# EAGLE design vcf3 (EAGLE 7.2.0)
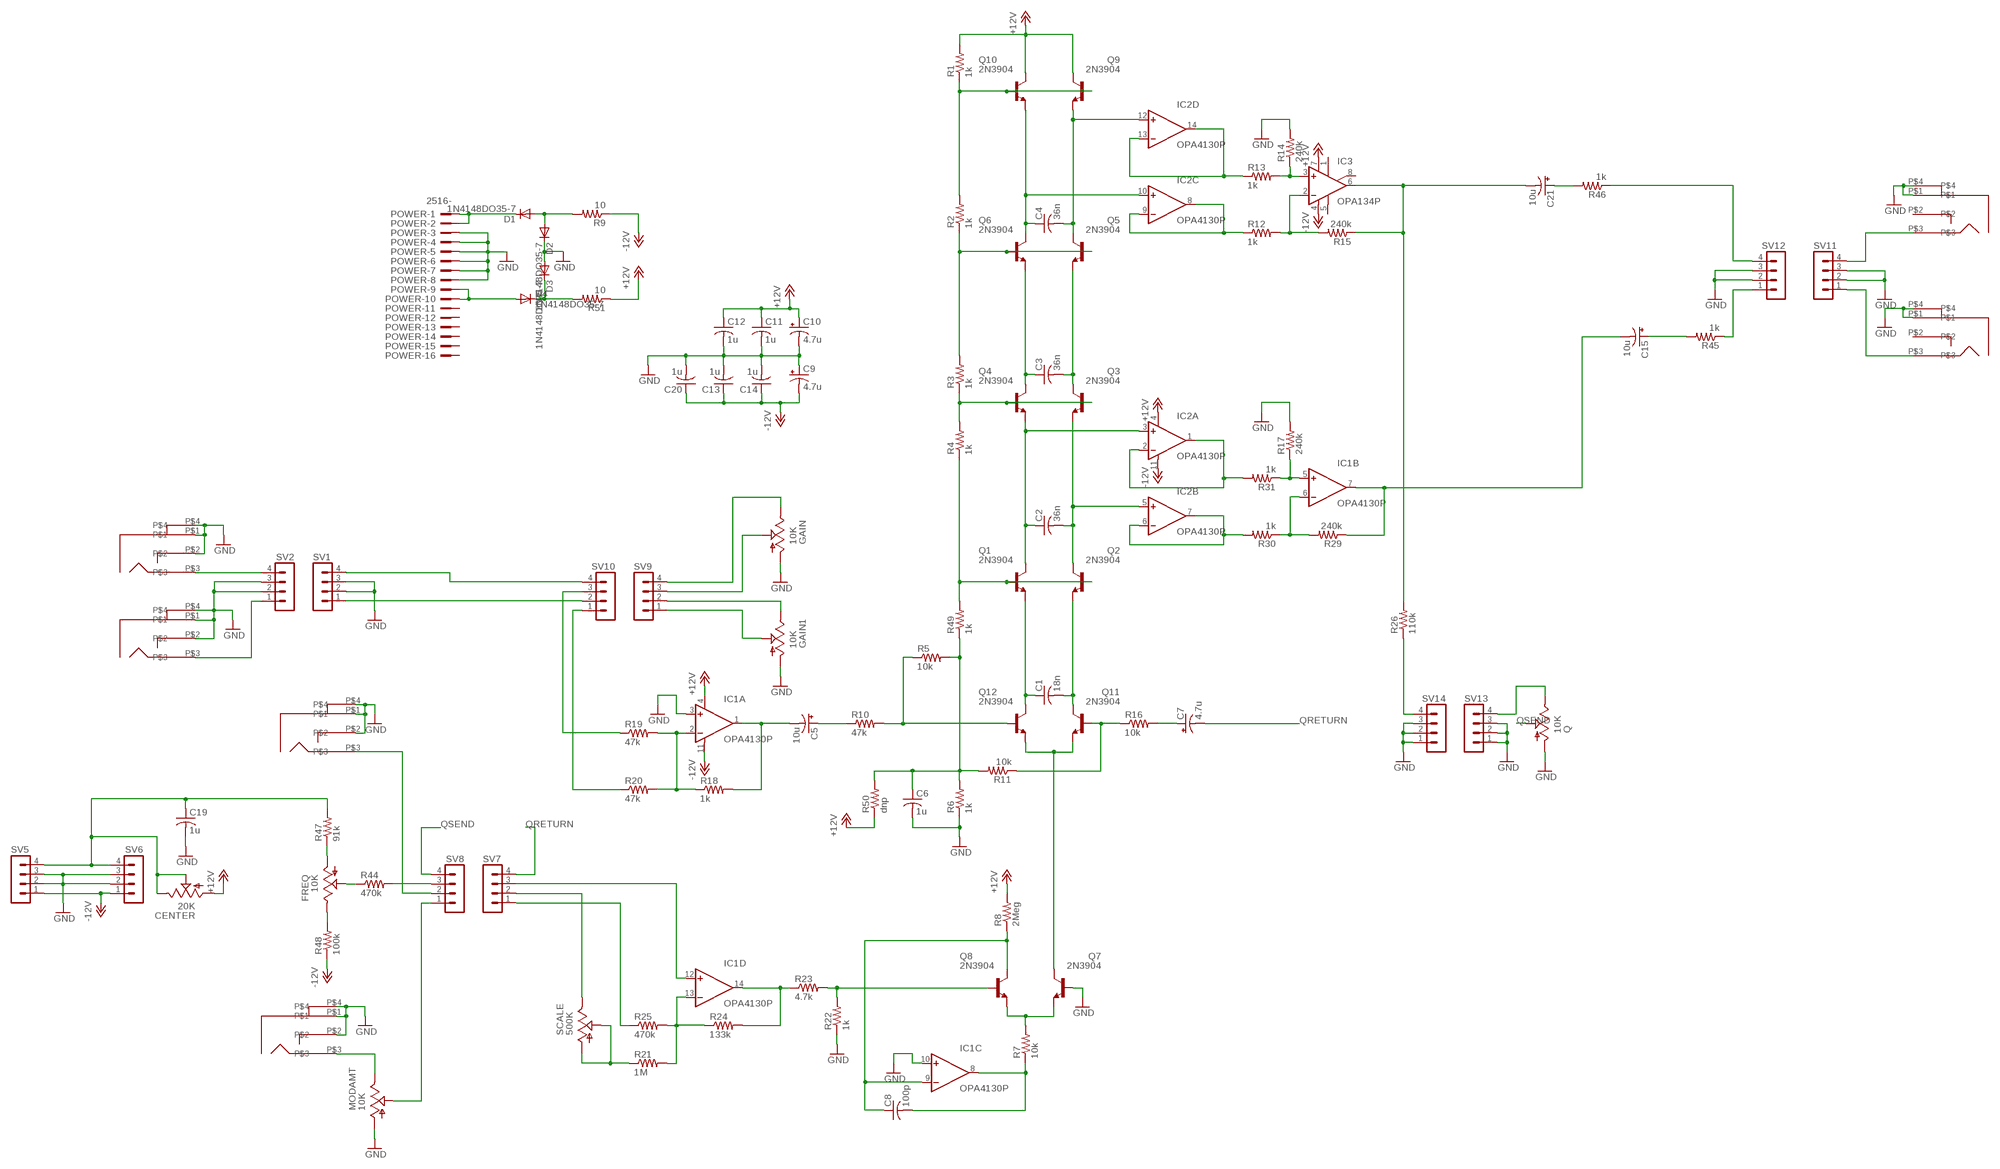
[diagram p0: schematic, sheet 1]

## Parts
AIN  PJ301BM  [PJ301BM]
AIN2  PJ301BM  [PJ301BM]
BP  PJ301BM  [PJ301BM]
C1  18n  C-US050-025X075  [C050-025X075]
C2  36n  C-US050-025X075  [C050-025X075]
C3  36n  C-US050-025X075  [C050-025X075]
C4  36n  C-US050-025X075  [C050-025X075]
C5  10u  CPOL-USE2.5-6  [E2,5-6]
C6  1u  C-US050-025X075  [C050-025X075]
C7  4.7u  CPOL-USE2.5-6  [E2,5-6]
C8  100p  C-US050-025X075  [C050-025X075]
C9  4.7u  CPOL-USE2.5-6  [E2,5-6]
C10  4.7u  CPOL-USE2.5-6  [E2,5-6]
C11  1u  C-US050-025X075  [C050-025X075]
C12  1u  C-US050-025X075  [C050-025X075]
C13  1u  C-US050-025X075  [C050-025X075]
C14  1u  C-US050-025X075  [C050-025X075]
C15  10u  CPOL-USE2.5-6  [E2,5-6]
C19  1u  C-US050-025X075  [C050-025X075]
C20  1u  C-US050-025X075  [C050-025X075]
C21  10u  CPOL-USE2.5-6  [E2,5-6]
CENTER  20K  TRIM_US-S64W  [S64W]
D1  1N4148DO35-7  [DO35-7]
D2  1N4148DO35-7  [DO35-7]
D3  1N4148DO35-7  [DO35-7]
D4  1N4148DO35-7  [DO35-7]
FREQ  10K  US-EVUF2J  [EVUFXJ]
GAIN  10K  US-EVUF2J  [EVUFXJ]
GAIN1  10K  US-EVUF2J  [EVUFXJ]
IC1  OPA4130P  [DIL14]
IC2  OPA4130P  [DIL14]
IC3  OPA134P  [DIL08]
LP  PJ301BM  [PJ301BM]
MIN  PJ301BM  [PJ301BM]
MIN1  PJ301BM  [PJ301BM]
MODAMT  10K  US-EVUF2J  [EVUFXJ]
POWER  2516-  [PAK100/2500-16]
Q  10K  US-EVUF2J  [EVUFXJ]
Q1  2N3904  [TO92]
Q2  2N3904  [TO92]
Q3  2N3904  [TO92]
Q4  2N3904  [TO92]
Q5  2N3904  [TO92]
Q6  2N3904  [TO92]
Q7  2N3904  [TO92]
Q8  2N3904  [TO92]
Q9  2N3904  [TO92]
Q10  2N3904  [TO92]
Q11  2N3904  [TO92]
Q12  2N3904  [TO92]
R1  1k  R-US_0207/2V  [0207/2V]
R2  1k  R-US_0207/2V  [0207/2V]
R3  1k  R-US_0207/2V  [0207/2V]
R4  1k  R-US_0207/2V  [0207/2V]
R5  10k  R-US_0207/2V  [0207/2V]
R6  1k  R-US_0207/2V  [0207/2V]
R7  10k  R-US_0207/2V  [0207/2V]
R8  2Meg  R-US_0207/2V  [0207/2V]
R9  10  R-US_0207/2V  [0207/2V]
R10  47k  R-US_0207/2V  [0207/2V]
R11  10k  R-US_0207/2V  [0207/2V]
R12  1k  R-US_0207/2V  [0207/2V]
R13  1k  R-US_0207/2V  [0207/2V]
R14  240k  R-US_0207/2V  [0207/2V]
R15  240k  R-US_0207/2V  [0207/2V]
R16  10k  R-US_0207/2V  [0207/2V]
R17  240k  R-US_0207/2V  [0207/2V]
R18  1k  R-US_0207/2V  [0207/2V]
R19  47k  R-US_0207/2V  [0207/2V]
R20  47k  R-US_0207/2V  [0207/2V]
R21  1M  R-US_0207/2V  [0207/2V]
R22  1k  R-US_0207/2V  [0207/2V]
R23  4.7k  R-US_0207/2V  [0207/2V]
R24  133k  R-US_0207/2V  [0207/2V]
R25  470k  R-US_0207/2V  [0207/2V]
R26  110k  R-US_0207/2V  [0207/2V]
R29  240k  R-US_0207/2V  [0207/2V]
R30  1k  R-US_0207/2V  [0207/2V]
R31  1k  R-US_0207/2V  [0207/2V]
R44  470k  R-US_0204/7  [0204/7]
R45  1k  R-US_0207/2V  [0207/2V]
R46  1k  R-US_0207/2V  [0207/2V]
R47  91k  R-US_0204/7  [0204/7]
R48  100k  R-US_0204/7  [0204/7]
R49  1k  R-US_0207/2V  [0207/2V]
R50  dnp  R-US_0207/2V  [0207/2V]
R51  10  R-US_0207/2V  [0207/2V]
SCALE  500K  TRIM_US-S64W  [S64W]
SV1  MA04-1  [MA04-1]
SV2  MA04-1  [MA04-1]
SV5  MA04-1  [MA04-1]
SV6  MA04-1  [MA04-1]
SV7  MA04-1  [MA04-1]
SV8  MA04-1  [MA04-1]
SV9  MA04-1  [MA04-1]
SV10  MA04-1  [MA04-1]
SV11  MA04-1  [MA04-1]
SV12  MA04-1  [MA04-1]
SV13  MA04-1  [MA04-1]
SV14  MA04-1  [MA04-1]

## Nets
+12V: C10.+ C11.1 C12.1 CENTER.A IC1.4(A:V+) IC2.4(A:V+) IC3.7(V+) Q9.1(C) Q10.1(C) R1.2 R8.2 R50.1 R51.1
-12V: C9.- C13.1 C14.1 C20.1 IC1.11(A:V-) IC2.11(A:V-) IC3.4(V-) R9.1 R48.1 SV5.1 SV6.1
GND: AIN2.P$1 AIN2.P$2 AIN2.P$4 AIN.P$1 AIN.P$2 AIN.P$4 BP.P$1 BP.P$4 C6.2 C9.+ C10.- C11.2 C12.2 C13.2 C14.2 C19.2 C20.2 D2.C D3.A GAIN1.1(A) GAIN.1(A) IC1.3(A:+IN) IC1.10(C:+IN) LP.P$1 LP.P$4 MIN1.P$1 MIN1.P$2 MIN1.P$4 MIN.P$1 MIN.P$2 MIN.P$4 MODAMT.1(A) POWER.3 POWER.4 POWER.5 POWER.6 POWER.7 POWER.8 Q7.2(B) Q.1(A) R6.1 R14.2 R17.2 R22.1 SV1.2 SV1.3 SV2.2 SV2.3 SV5.2 SV5.3 SV6.2 SV6.3 SV11.2 SV11.3 SV12.2 SV12.3 SV13.1 SV13.2 SV13.3 SV14.1 SV14.2 SV14.3
N$1: Q7.1(C) Q11.3(E) Q12.3(E)
N$2: C1.1 Q1.3(E) Q12.1(C)
N$3: C2.1 IC2.3(A:+IN) Q1.1(C) Q4.3(E)
N$4: C3.1 Q4.1(C) Q6.3(E)
N$5: C3.2 Q3.1(C) Q5.3(E)
N$6: C2.2 IC2.5(B:+IN) Q2.1(C) Q3.3(E)
N$7: C1.2 Q2.3(E) Q11.1(C)
N$8: C4.2 IC2.12(D:+IN) Q5.1(C) Q9.3(E)
N$9: C4.1 IC2.10(C:+IN) Q6.1(C) Q10.3(E)
N$10: Q9.2(B) Q10.2(B) R1.1 R2.2
N$11: Q5.2(B) Q6.2(B) R2.1 R3.2
N$12: Q3.2(B) Q4.2(B) R3.1 R4.2
N$13: Q1.2(B) Q2.2(B) R4.1 R49.2
N$14: Q12.2(B) R5.1 R10.2
N$15: IC1.2(A:-IN) R18.1 R19.2 R20.2
N$16: Q7.3(E) Q8.3(E) R7.2
N$17: C8.2 IC1.8(C:OUT) R7.1
N$18: MIN.P$3 MODAMT.3(E)
N$19: C8.1 IC1.9(C:-IN) Q8.1(C) R8.1
N$20: C5.- IC1.1(A:OUT) R18.2
N$21: C5.+ R10.1
N$22: Q11.2(B) R11.1 R16.1
N$23: IC2.13(D:-IN) IC2.14(D:OUT) R13.1
N$24: IC1.12(D:+IN) SV7.3
N$25: IC3.2(-IN) R12.2 R15.2
N$26: IC3.3(+IN) R13.2 R14.1
N$27: D3.C D4.C R51.2
N$28: MIN1.P$3 SV8.2
N$29: D1.A D2.A R9.2
N$30: SV1.1 SV10.2
N$31: C7.+ R16.2
N$32: R26.1 SV14.4
N$33: R21.1 SCALE.A SCALE.S
N$34: Q8.2(B) R22.2 R23.2
N$35: IC2.8(C:OUT) IC2.9(C:-IN) R12.1
N$36: IC1.13(D:-IN) R21.2 R24.1 R25.2
N$37: IC2.1(A:OUT) IC2.2(A:-IN) R31.2
N$38: SCALE.E SV7.2
N$39: C15.+ R45.2
N$40: C19.1 CENTER.E CENTER.S R47.2 SV5.4 SV6.4
N$43: R19.1 SV10.3
N$44: IC2.6(B:-IN) IC2.7(B:OUT) R30.2
N$45: IC1.5(B:+IN) R17.1 R31.1
N$46: IC1.6(B:-IN) R29.2 R30.1
N$47: C15.- IC1.7(B:OUT) R29.1
N$49: R45.1 SV12.1
N$50: MODAMT.2(S) SV8.1
N$52: C21.- IC3.6(OUT) R15.1 R26.2
N$53: IC1.14(D:OUT) R23.1 R24.2
N$57: GAIN1.3(E) SV9.2
N$60: FREQ.1(A) R47.1
N$62: SV1.4 SV10.4
N$63: C21.+ R46.2
N$64: R46.1 SV12.4
N$65: FREQ.2(S) R44.1
N$66: FREQ.3(E) R48.2
N$68: C6.1 R5.2 R6.2 R11.2 R49.1 R50.2
N$71: D4.A POWER.9 POWER.10
N$72: D1.C POWER.1 POWER.2
N$75: AIN.P$3 SV2.4
N$76: AIN2.P$3 SV2.1
N$80: R44.2 SV8.3
N$81: R25.1 SV7.1
N$82: BP.P$3 SV11.1
N$83: LP.P$3 SV11.4
N$84: R20.1 SV10.1
N$85: GAIN.3(E) SV9.4
N$86: GAIN.2(S) SV9.3
N$88: GAIN1.2(S) SV9.1
N$89: Q.3(E) SV13.4
QRETURN: C7.- SV7.4
QSEND: Q.2(S) SV8.4
Unconnected: BP.P$2 IC3.1(ON1) IC3.5(OPT) IC3.8(ON2) LP.P$2 POWER.11 POWER.12 POWER.13 POWER.14 POWER.15 POWER.16

## Library data of the parts
AIN AIN2 BP LP MIN MIN1 = dan:PJ301BM
C1-C4 C6 C8 C11-C14 C19 C20 = dan:C-US: CAPACITOR, American symbol
C5 C7 C9 C10 C15 C21 = dan:CPOL-US: POLARIZED CAPACITOR, American symbol
CENTER SCALE = dan:TRIM_US-: POTENTIOMETER
D1-D4 = dan:1N4148: DIODE high speed (Philips)
FREQ GAIN GAIN1 MODAMT Q = dan:US-EVU: 9 mm Square Rotary Potentiometers Source: Panasonic
IC1 IC2 = dan:OPA4130: Low Power, Precision FET-Input Operational Amplifiers; OC_FARNELL: unknown; OC_NEWARK: unknown
IC3 = dan:OPA134: AUDIO AMPLIFIER
POWER = dan:2516-: 3M (TM) Pak 100 4-Wall Header Source: 3M; OC_FARNELL: unknown; OC_NEWARK: unknown
Q1-Q12 = dan:2N3904: NPN Transistor
R1-R26 R29-R31 R44-R51 = dan:R-US_: RESISTOR, American symbol
SV1 SV2 SV5-SV14 = dan:MA04-1: PIN HEADER; OC_FARNELL: unknown; OC_NEWARK: unknown

## Board
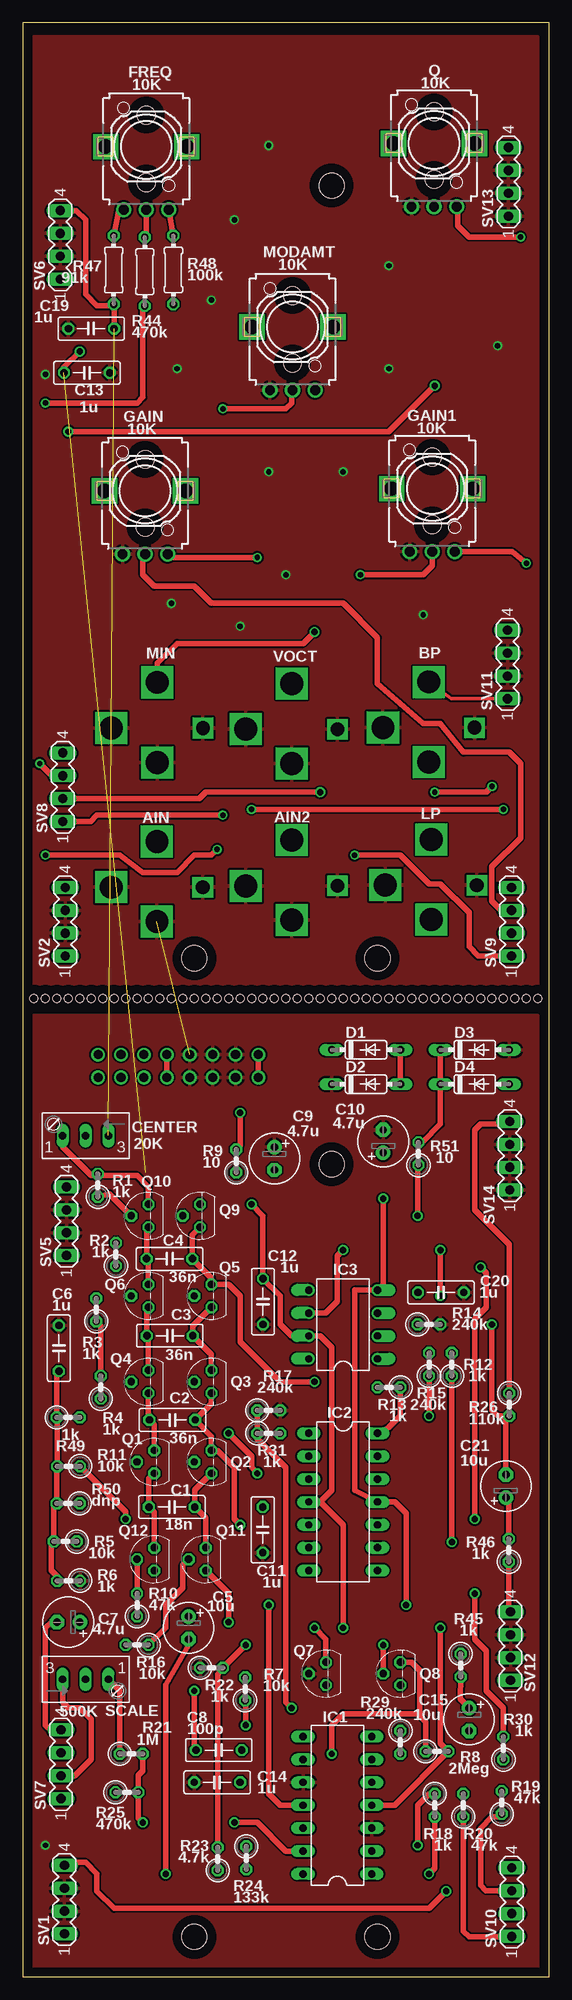
[diagram p1: board, top side]
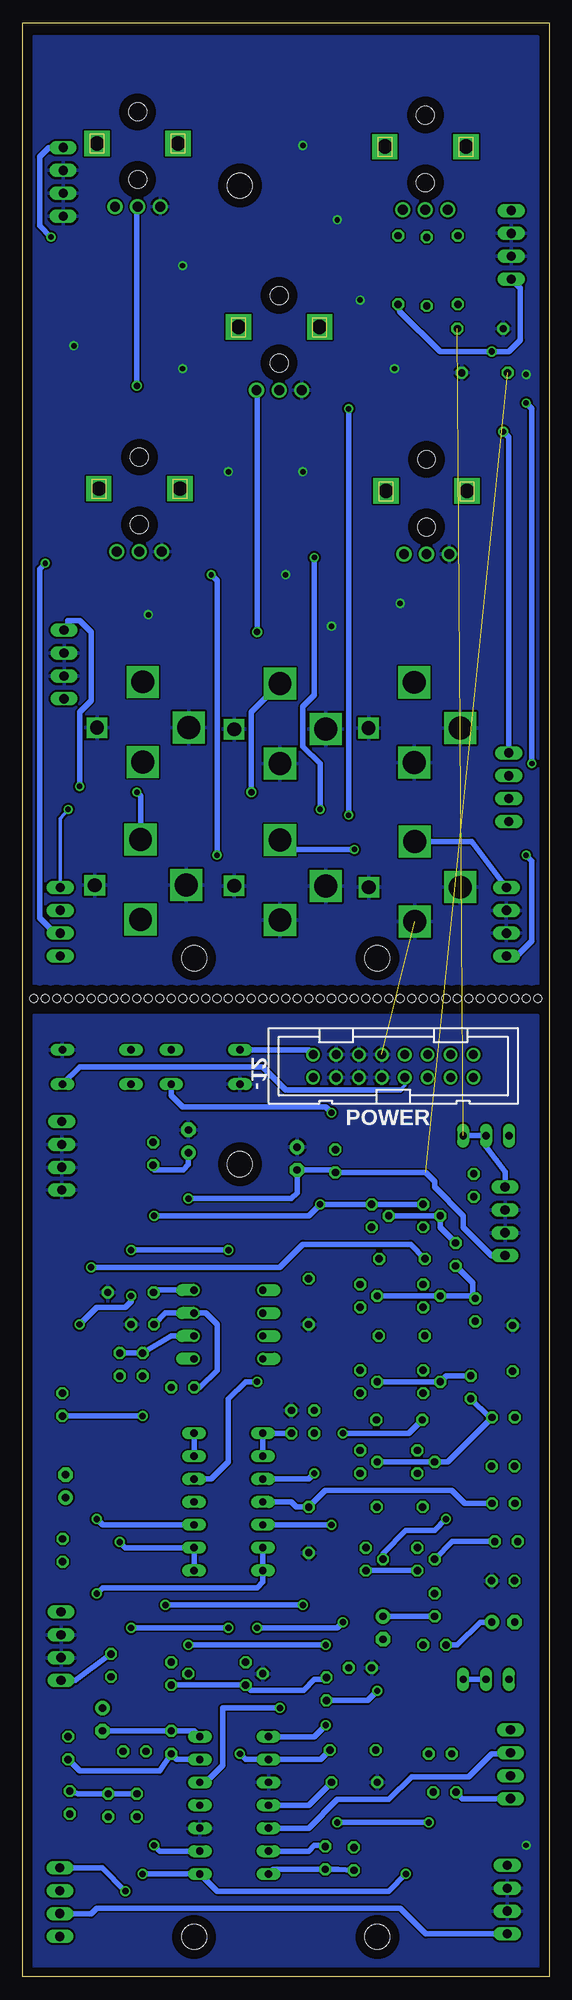
[diagram p2: board, bottom side, seen from below]

Size 58.4 x 216.84 mm. Coordinates in mm from the lower left corner, seen from the top.
Outline: 0,0 58.4,0 58.4,216.84 0,216.84 0,0
Copper layers (1*16): Top 0.035mm / dielectric 1.5mm / Bottom 0.035mm
Design rules "default *": minimum track width 10mil, minimum drill 20mil, track to track 8mil, track to pad 8mil, pad to pad 8mil, via to via 8mil, smd to smd 8mil, copper to edge 40mil, drill to drill 8mil, minimum pad ring 10mil, minimum via ring 8mil, stop-mask expansion 4mil, vias tented up to drill 0mil, thermal gap 10mil
Holes 2.8 mm at 39.37,4.45 19.05,4.45 34.29,90.17 39.37,113.03 19.05,113.03 34.29,198.75
Holes 0.9 mm at 1.27,108.58 2.54,108.58 3.81,108.58 5.08,108.58 6.35,108.58 7.62,108.58 8.89,108.58 10.16,108.58 11.43,108.58 12.7,108.58 13.97,108.58 15.24,108.58 16.51,108.58 17.78,108.58 19.05,108.58 20.32,108.58 21.59,108.58 22.86,108.58 24.13,108.58 25.4,108.58 26.67,108.58 27.94,108.58 29.21,108.58 30.48,108.58 31.75,108.58 33.02,108.58 34.29,108.58 35.56,108.58 36.83,108.58 38.1,108.58 39.37,108.58 40.64,108.58 41.91,108.58 43.18,108.58 44.45,108.58 45.72,108.58 46.99,108.58 48.26,108.58 49.53,108.58 50.8,108.58 52.07,108.58 53.34,108.58 54.61,108.58 55.88,108.58 57.15,108.58

### Footprints (pad centres in the part's own frame; a part is rotated, then mirrored left to right if it is on the bottom)
PJ301BM = drill 1.524 square: P$1 5.08,0 | drill 2.54 square: P$2 0,-3.81; P$3 0,5.08; P$4 -5.08,0
C050-025X075 = drill 0.813 octagon: 1 -2.54,0; 2 2.54,0
E2,5-6 = drill 0.813 pad 1.6: + -1.27,0 | drill 0.813 pad 1.6 octagon: - 1.27,0
S64W = drill 0.813 long: A 2.54,1.27; E -2.54,1.27; S 0,1.27
DO35-7 = drill 0.813 long: A 3.81,0; C -3.81,0
EVUFXJ = drill 1.1 pad 1.676: 1 -2.5,-7; 2 0,-7; 3 2.5,-7 | drill 1.6 pad 2.8 square: M1 4.5,0; M2 -4.5,0 | hole 2: 0,3.5; 0,-4
DIL14 = drill 0.813 long: 1 -7.62,-3.81; 2 -5.08,-3.81; 3 -2.54,-3.81; 4 0,-3.81; 5 2.54,-3.81; 6 5.08,-3.81; 7 7.62,-3.81; 8 7.62,3.81; 9 5.08,3.81; 10 2.54,3.81; 11 0,3.81; 12 -2.54,3.81; 13 -5.08,3.81; 14 -7.62,3.81
DIL08 = drill 0.813 offset: 1 -3.81,-3.81; 2 -1.27,-3.81; 3 1.27,-3.81; 4 3.81,-3.81; 5 3.81,3.81; 6 1.27,3.81; 7 -1.27,3.81; 8 -3.81,3.81
PAK100/2500-16 = drill 1 pad 1.422: 1 -8.89,-1.27; 2 -8.89,1.27; 3 -6.35,-1.27; 4 -6.35,1.27; 5 -3.81,-1.27; 6 -3.81,1.27; 7 -1.27,-1.27; 8 -1.27,1.27; 9 1.27,-1.27; 10 1.27,1.27; 11 3.81,-1.27; 12 3.81,1.27; 13 6.35,-1.27; 14 6.35,1.27; 15 8.89,-1.27; 16 8.89,1.27
TO92 = drill 0.813 octagon: 1 1.27,0; 2 0,1.905; 3 -1.27,0
0207/2V = drill 0.813 octagon: 1 -1.27,0; 2 1.27,0
0204/7 = drill 0.813 octagon: 1 -3.81,0; 2 3.81,0
MA04-1 = drill 1.016 long: 1 -3.81,0; 2 -1.27,0; 3 1.27,0; 4 3.81,0

### Placement (x,y rotation side)
AIN  14.91,120.9 0 top
AIN2  29.84,121.06 0 top
BP  45.06,138.61 0 top
C1  16.56,52.15 0 top
C2  16.61,61.8 0 top
C3  16.33,71.15 0 top
C4  16.31,79.68 0 top
C5  18.41,38.73 270 top
C6  4.04,69.75 90 top
C7  5.08,39.37 180 top
C8  21.77,25.17 180 top
C9  27.94,90.81 270 top
C10  40.01,92.71 90 top
C11  26.64,49.61 270 top
C12  26.67,74.93 270 top
C13  7.14,177.98 0 top
C14  21.59,21.59 180 top
C15  49.53,28.57 270 top
C19  7.62,182.88 180 top
C20  46.41,75.95 0 top
C21  53.62,54.46 90 top
CENTER  6.99,94.61 180 top
D1  38.1,102.87 0 top
D2  38.1,99.06 0 top
D3  50.16,102.87 0 top
D4  50.16,99.06 0 top
FREQ  13.72,203.07 0 top
GAIN  13.59,164.87 0 top
GAIN1  45.44,165.13 0 top
IC1  34.92,19.05 90 top
IC2  35.56,52.7 270 top
IC3  35.56,72.39 90 top
LP  45.31,121.13 0 top
MIN  14.94,138.56 0 top
MIN1  29.84,138.43 0 top
MODAMT  29.95,183.06 0 top
POWER  17.27,101.07 0 bottom
Q  45.64,203.43 0 top
Q1  14.61,57.15 90 top
Q2  20.95,57.15 90 top
Q3  20.95,66.04 90 top
Q4  13.97,66.04 90 top
Q5  20.95,75.56 90 top
Q6  13.97,75.56 90 top
Q7  33.66,33.66 90 top
Q8  41.91,33.66 90 top
Q9  19.68,84.45 90 top
Q10  13.97,84.45 90 top
Q11  20.32,46.35 90 top
Q12  14.61,46.35 90 top
R1  8.36,87.83 90 top
R2  10.36,80.16 90 top
R3  8.18,74.02 90 top
R4  8.69,65.43 90 top
R5  4.75,48.31 180 top
R6  5.11,43.97 180 top
R7  24.69,31.95 90 top
R8  45.97,25.04 0 top
R9  23.7,90.53 90 top
R10  12.7,41.27 90 top
R11  5.11,56.67 180 top
R12  47.62,67.94 90 top
R13  40.64,65.41 180 top
R14  45.09,72.39 0 top
R15  45.09,67.94 90 top
R16  12.7,36.83 180 top
R17  27.3,62.87 0 top
R18  45.72,19.05 270 top
R19  53.16,19.35 90 top
R20  48.9,19.05 90 top
R21  12.06,24.77 0 top
R22  20.95,34.29 0 top
R23  21.64,13.11 90 top
R24  24.82,13.21 270 top
R25  11.58,20.5 0 top
R26  53.98,63.5 270 top
R29  41.91,26.04 270 top
R30  53.34,25.4 90 top
R31  27.3,60.33 0 top
R44  13.56,189.2 270 top
R45  48.59,34.57 270 top
R46  53.95,47.35 90 top
R47  10.11,189.38 270 top
R48  16.74,189.38 90 top
R49  5.05,62.08 0 top
R50  5.05,52.55 180 top
R51  43.92,91.34 90 top
SCALE  6.99,31.75 0 top
SV1  4.65,8.59 90 top
SV2  4.72,117.07 90 top
SV5  4.88,83.85 90 top
SV6  4.19,192.18 90 top
SV7  4.27,23.6 90 top
SV8  4.47,132 90 top
SV9  54.23,117.07 90 top
SV10  54.25,8.31 90 top
SV11  53.8,145.62 90 top
SV12  54.13,36.7 90 top
SV13  53.9,199.16 90 top
SV14  54.05,91.11 90 top

### Tracks (layer width: path | path; a pad name or v marks a point on that pad's centre or on a via)
+12V  (via drill 0.7)
  Top 0.61: IC2.4 33.02,52.7 | 33.02,52.7 34.29,53.98 34.29,69.85 33.02,71.12 IC3.7 29.84,71.12 28.57,72.39 28.57,75.56 C12.1 26.67,84.45 v25.4,85.72 | Q10.1 13.97,87.63 12.7,88.9 8.56,88.9 R1.2 8.46,89.1 8.26,88.9 7.62,88.9 4.45,92.08 CENTER.A | 33.02,52.7 35.56,50.16 v35.56,38.73 | v46.35,38.73 46.35,25.93 R8.2 47.24,25.02 41.27,19.05 IC1.4 | v43.81,84.45 43.81,89.97 R51.1
  Bottom 0.406: 43.92,89.64 43.81,89.53
  Bottom 0.61: R51.1 43.92,89.64 | 43.81,89.53 40.59,89.53 40.01,90.12 C10.+ | R50.1 9.37,52.55 10.79,53.98 24.82,53.98 C11.1 28.02,52.15 28.57,52.7 IC2.4 | Q10.1 Q9.1 v25.4,85.72 26.67,84.45 v43.81,84.45 | v35.56,38.73 v46.35,38.73
-12V  (via drill 0.7)  (1 unrouted)
  Top 0.61: v40.01,86.36 40.01,76.83 IC3.4 36.83,76.2 36.83,53.98 IC2.11 41.27,52.7 42.55,51.44 v42.55,41.27 | IC1.11 28.57,19.05 27.3,20.32 v27.3,41.27 | C13.1 4.6,178.59 v6.35,180.34
  Bottom 0.61: R48.1 16.59,184.78 12.06,180.34 v6.35,180.34 4.45,180.34 3.17,181.61 3.17,187.35 SV6.1 | IC3.4 43.61,76.2 C20.1 | v40.01,86.36 28.57,86.36 27.94,87 C9.- 23.98,89.53 R9.1 13.69,89.26 12.7,88.27 12.7,87.63 9.53,84.45 9.53,83.19 6.35,80.01 4.9,80.01 SV5.1 | IC1.11 26.67,19.05 C14.1 | v27.3,41.27 v42.55,41.27
GND  (via drill 0.6)  (1 unrouted)
  other vias: 2.54,14.61 35.56,167 27.3,167 29.21,155.57 16.51,152.4 17.14,178.44 40.64,178.44 52.7,180.97 44.45,151.13 24.13,149.86 2.54,177.8 20.95,186.06 40.64,189.87 23.5,194.94 27.3,203.2
  pour Top: 1.27,106.68 57.15,106.68 57.15,0.64 1.27,0.64
  pour Top: 57.15,215.26 1.27,215.26 1.27,109.86 57.15,109.86
  pour Bottom: 1.27,106.68 57.15,106.68 57.15,0.64 1.27,0.64
  pour Bottom: 1.27,215.26 57.15,215.26 57.15,109.86 1.27,109.86
N$1  (via drill 0.7)
  Top 0.61: Q7.1 33.66,37.47 v32.38,38.73 | v22.86,39.37 22.86,42.55 Q11.3
  Bottom 0.61: Q12.3 Q11.3 | v32.38,38.73 23.5,38.73 v22.86,39.37
N$2
  Top 0.61: Q12.1 14.61,51.56 C1.1 14.02,55.3 Q1.3
N$3  (via drill 0.7)
  Top 0.61: Q1.1 14.61,61.27 C2.1 13.97,61.9 Q4.3 | v22.86,60.33 25.4,57.78 25.4,56.52 v26.04,55.88
  Bottom 0.61: v22.86,60.33 15.54,60.33 C2.1 | v26.04,55.88 26.67,55.24 IC2.3
N$4
  Top 0.61: Q6.3 13.79,74.12 C3.1 13.97,70.97 Q4.1
N$5
  Top 0.61: Q3.1 20.95,69.06 C3.2 18.87,72.21 Q5.3
N$6  (via drill 0.7)
  Top 0.61: Q3.3 20.95,63.6 C2.2 20.95,59.99 Q2.1 21.59,58.42 23.5,56.52 23.5,50.8 v24.13,50.16
  Bottom 0.61: v24.13,50.16 IC2.5
N$7
  Top 0.61: Q11.1 20.32,50.93 C1.2 19.1,54.03 Q2.3
N$8  (via drill 0.7)
  Top 0.61: Q9.3 18.85,82.35 C4.2 20.95,77.57 Q5.1 22.86,76.83 24.13,75.56 24.13,70.48 28.57,66.04 v32.38,66.04
  Bottom 0.61: IC2.12 37.47,55.24 35.56,57.15 35.56,64.14 33.66,66.04 v32.38,66.04
N$9  (via drill 0.7)
  Top 0.61: Q10.3 13.77,82.98 C4.1 13.97,79.48 Q6.1 | v50.16,50.8 50.16,73.03 51.44,74.3 51.44,78.11 v50.8,78.74
  Bottom 0.61: IC2.10 49.53,50.16 v50.16,50.8 | v50.8,78.74 29.84,78.74 27.3,81.28 15.37,81.28 C4.1
N$10
  Top 0.61: R1.1 9.63,86.89 Q10.2
  Bottom 0.61: Q9.2 Q10.2 12.06,83.13 R2.2
N$11
  Bottom 0.61: Q5.2 Q6.2 8.46,75.56 | 8.46,75.56 R3.2 | 8.46,75.56 8.46,76.99 R2.1
N$12
  Top 0.61: R4.2 8.69,72.24 R3.1
  Bottom 0.61: R4.2 11.4,66.7 Q4.2 Q3.2
N$13
  Bottom 0.61: Q2.2 Q1.2 11.25,57.15 R49.2 6.6,62.08 R4.1
N$14
  Top 0.61: R10.2 Q12.2
  Bottom 0.61: R5.1 10.74,48.31 Q12.2
N$15  (via drill 0.7)
  Top 0.61: v43.81,14.61 43.81,19.05 45.09,20.32 R18.1
  Bottom 0.61: R18.1 R20.2 52.22,20.32 R19.2 | IC1.2 43.18,13.97 v43.81,14.61
N$16
  Bottom 0.61: Q8.3 Q7.3 33.1,31.83 27.23,31.83 26.04,33.02 24.89,33.02 R7.2
N$17  (via drill 0.7)
  Top 0.61: v19.05,31.75 19.05,25.35 C8.2 | v24.77,27.94 24.77,30.35 R7.1
  Bottom 0.61: 19.13,31.83 v19.05,31.75 20.12,30.68 R7.1 | IC1.8 26.04,26.67 v24.77,27.94
N$18  (via drill 0.7)
  Top 0.61: MIN.P$3 14.94,145.75 17.14,147.96 31.11,147.96 v32.38,149.22
  Bottom 0.61: v32.38,149.22 32.38,176 MODAMT.3
N$19  (via drill 0.7)
  Top 0.61: Q8.1 43.18,34.92 44.07,34.04 44.07,29.21 43.81,29.21 | v34.29,24.77 34.29,27.94 35.56,29.21 43.81,29.21 | R8.1 44.7,28.32 43.81,29.21
  Bottom 0.61: C8.1 25.35,24.13 IC1.9 33.66,24.13 v34.29,24.77
N$20  (via drill 0.7)
  Top 0.61: R18.2 45.72,12.06 v45.09,11.43 | v15.88,11.43 15.88,32.38 18.41,36.83 C5.-
  Bottom 0.61: v45.09,11.43 IC1.1 36.83,9.53 17.78,9.53 v15.88,11.43
N$21
  Bottom 0.61: R10.1 C5.+
N$22  (via drill 0.7)
  Top 0.61: v11.43,50.8 11.43,51.61 R11.1 | Q11.2 17.78,45.72 17.78,43.18 15.88,41.27 15.88,38.73 R16.1
  Bottom 0.61: Q11.2 18.41,46.99 15.88,49.53 12.7,49.53 v11.43,50.8
N$23
  Top 0.61: R13.1 41.91,62.23 40.64,60.96 IC2.14
  Bottom 0.61: IC2.13 IC2.14
N$24
  Bottom 0.61: IC1.12 26.67,16.51 23.5,19.68 17.78,19.68 15.24,22.23 8.89,22.23 6.35,24.77 4.37,24.77 SV7.3
N$25
  Bottom 0.61: IC3.2 41.91,71.12 R15.2 R12.2
N$26
  Bottom 0.61: R14.1 42.55,73.66 IC3.3 38.1,73.66 36.83,72.39 36.83,67.31 38.73,65.41 R13.2
N$27
  Top 0.406: R51.2 44.35,92.61
  Top 0.61: D3.C D4.C 46.35,94.61 44.35,92.61
N$28  (via drill 0.7)
  Top 0.61: SV8.2 19.61,130.73 20.32,131.44 v33.02,131.44
  Bottom 0.61: v33.02,131.44 33.02,140.34 MIN1.P$3
N$29  (via drill 0.7)
  Top 0.61: D1.A D2.A | v24.13,95.89 24.13,92.23 R9.2
  Bottom 0.61: D2.A 41.91,97.79 40.64,96.52 24.77,96.52 v24.13,95.89
N$30
  Bottom 0.61: SV1.1 13.66,4.78 16.51,7.62 50.16,7.62 50.8,6.99 54.2,6.99 SV10.2
N$31
  Bottom 0.61: R16.2 10.16,36.83 7.62,39.37 C7.+
N$32
  Top 0.61: R26.1 53.98,81.28 50.16,85.09 50.16,93.98 50.8,94.61 54.36,94.61 SV14.4
N$33
  Top 0.61: R21.1 10.79,31.75 SCALE.A
  Bottom 0.61: SCALE.S SCALE.A
N$34  (via drill 0.7)
  Top 0.61: v24.77,36.83 R22.2 21.64,33.6 21.64,14.66 21.59,14.61 21.59,14.88 R23.2 | v40.01,36.83 Q8.2
  Bottom 0.61: v24.77,36.83 v40.01,36.83
N$35  (via drill 0.7)
  Top 0.61: v47.62,48.26 R12.1
  Bottom 0.61: IC2.8 IC2.9 46.99,47.62 v47.62,48.26
N$36  (via drill 0.7)
  Top 0.61: R21.2 13.34,22.86 12.85,22.38 R25.2 12.85,17.63 v13.34,17.14 | v23.5,17.14 26.04,17.14 29.21,13.97 IC1.13
  Bottom 0.61: IC1.13 26.67,13.97 26.04,14.61 25.58,14.61 R24.1 | v13.34,17.14 v23.5,17.14
N$37
  Bottom 0.61: IC2.2 IC2.1 R31.2
N$38
  Top 0.61: SV7.2 5.82,22.33 7.62,24.13 7.62,28.57 6.35,29.84 5.08,29.84 4.45,30.48 SCALE.E
N$39
  Top 0.61: R45.2 48.54,30.84 C15.+
N$40  (1 unrouted)
  Top 0.61: SV6.4 5.94,195.99 6.99,194.94 6.99,186.69 8.26,185.42 9.96,185.42 R47.2 10.16,185.52 C19.1
  Bottom 0.61: SV5.4 4.88,89.33 6.99,92.08 CENTER.S CENTER.E
N$43
  Top 0.61: SV10.3 51.38,9.58 50.8,10.16 50.8,16.51 52.07,17.78 52.83,17.78 R19.1
N$44  (via drill 0.7)
  Top 0.61: v50.16,42.55 50.16,37.47 51.44,36.2 51.44,31.75 53.34,29.84 R30.2
  Bottom 0.61: IC2.6 IC2.7 31.75,43.81 32.38,43.18 49.53,43.18 v50.16,42.55
N$45  (via drill 0.7)
  Top 0.61: R17.1 R31.1 26.04,59.69 29.21,56.52 29.21,30.48 v29.84,29.84
  Bottom 0.61: v29.84,29.84 36.2,29.84 36.2,23.5 38.1,21.59 IC1.5
N$46
  Bottom 0.61: IC1.6 41.27,24.13 R29.2 43.18,22.86 52.07,22.86 R30.1
N$47
  Bottom 0.61: IC1.7 39.37,27.3 R29.1 C15.-
N$49
  Bottom 0.61: SV12.1 52.55,32.89 R45.1
N$50  (via drill 0.6)
  Top 0.406: 29.84,175.96 MODAMT.2
  Top 0.61: v22.23,173.99 29.21,173.99 29.84,174.62 29.84,175.96 | v22.23,128.91 8.26,128.91 7.54,128.19 SV8.1
  Bottom 0.61: v22.23,128.91 v22.23,173.99
N$52  (via drill 0.7)
  Top 0.61: C21.- 53.62,61.87 | 53.62,61.87 R26.2 | IC3.6 33.66,73.66 34.92,74.93 34.92,80.01 v35.56,80.64 | v46.35,80.64 v46.35,75.56 | v52.07,72.39 52.07,62.87 52.7,62.23 53.26,62.23 53.62,61.87 | R15.1 v45.09,62.23
  Bottom 0.61: v35.56,80.64 v46.35,80.64 | v46.35,75.56 46.35,74.93 46.99,74.3 50.16,74.3 v52.07,72.39 | v45.09,62.23 R26.2
N$53
  Bottom 0.61: R23.1 23.44,11.94 R24.2 30.61,11.94 IC1.14
N$57  (via drill 0.6)
  Top 0.61: v55.88,156.84 54.3,158.12 GAIN1.3
  Bottom 0.406: SV9.2 54.84,115.8
  Bottom 0.61: 54.84,115.8 56.52,117.47 56.52,156.21 v55.88,156.84
N$60
  Top 0.406: 10.74,196.24 FREQ.1
  Top 0.61: R47.1 10.74,196.24
N$62  (via drill 0.7)
  Top 0.61: v46.99,9.53 45.09,7.62 10.16,7.62 8.26,9.53 8.26,11.43 6.99,12.7 4.95,12.7 SV1.4
  Bottom 0.61: SV10.4 49.58,12.12 v46.99,9.53
N$63
  Top 0.61: R46.2 53.95,52.88 C21.+
N$64
  Top 0.61: R46.1 53.95,40.69 SV12.4
N$65
  Top 0.406: 13.72,192.75 R44.1
  Top 0.61: FREQ.2 13.72,192.75
N$66
  Top 0.406: FREQ.3
  Top 0.61: FREQ.3 R48.2
N$68
  Top 0.61: R6.2 3.83,44.42 3.17,45.09 3.17,48.01 R5.2 3.48,52.25 R50.2 3.79,56.62 R11.2 3.83,62.03 R49.1 3.79,66.95 C6.1
N$71
  Top 0.61: POWER.10 POWER.9
  Bottom 0.406: POWER.9 16,98.93 16.51,98.42
  Bottom 0.61: 16.51,98.42 29.21,98.42 31.75,100.97 52.07,100.97 D4.A
N$72
  Top 0.61: POWER.2 POWER.1
  Bottom 0.406: POWER.2 26.16,102.36
  Bottom 0.61: 26.16,102.36 26.67,102.87 D1.C
N$75
  Bottom 0.61: AIN.P$3 8.56,125.98 SV2.4
N$76  (via drill 0.6)
  Top 0.61: v2.54,124.46 10.79,124.46 13.34,122.56 17.14,122.56 19.05,124.46 20.95,124.46 v21.59,125.09
  Bottom 0.406: 28.98,125.09 AIN2.P$3
  Bottom 0.61: v21.59,125.09 28.98,125.09 | SV2.1 3.58,113.26 1.91,114.94 1.91,123.83 v2.54,124.46
N$80  (via drill 0.6)
  Top 0.406: 13.34,184.95 R44.2
  Top 0.61: SV8.3 3.25,133.27 v1.91,134.62 | v2.54,174.62 12.7,174.62 13.34,175.26 13.34,184.95
  Bottom 0.61: v1.91,134.62 1.91,173.99 v2.54,174.62
N$81
  Bottom 0.61: SV7.1 9.6,19.79 R25.1
N$82
  Top 0.406: SV11.1 47.57,141.81 BP.P$3
N$83  (via drill 0.6)
  Top 0.61: v45.72,131.44 51.44,131.44 v52.07,132.08
  Bottom 0.406: 53.37,150.5 SV11.4
  Bottom 0.61: LP.P$3 45.31,131.04 v45.72,131.44 | v52.07,132.08 52.07,140.34 50.8,141.6 50.8,149.22 52.07,150.5 53.37,150.5
N$84
  Top 0.61: R20.1 48.9,5.08 49.53,4.45 54.2,4.45 SV10.1
N$85  (via drill 0.6)
  Top 0.406: 16.48,157.48 GAIN.3
  Top 0.61: v53.34,129.54 v25.4,129.54 | v26.04,157.48 16.48,157.48
  Bottom 0.406: SV9.4 54.23,128.52 v53.34,129.54
  Bottom 0.61: v26.04,157.48 26.04,142.24 27.3,140.97 27.3,136.53 25.4,134.62 v25.4,129.54
N$86
  Top 0.406: SV9.3 53.11,118.34 | 13.34,158.25 GAIN.2
  Top 0.61: 53.11,118.34 52.07,119.38 52.07,123.19 55.24,126.36 55.24,134.62 53.98,135.89 48.9,135.89 46.35,139.06 44.45,139.06 39.37,143.51 39.37,148.59 35.56,152.4 20.95,152.4 19.05,154.31 14.61,154.31 13.34,155.57 13.34,158.25
N$88  (via drill 0.6)
  Top 0.61: v37.47,155.57 44.45,155.57 45.44,156.57 GAIN1.2 | SV9.1 50.57,113.26 49.53,114.3 49.53,118.11 46.35,121.28 45.09,121.28 41.91,124.46 v36.83,124.46
  Bottom 0.61: v36.83,124.46 36.83,154.94 v37.47,155.57
N$89  (via drill 0.6)
  Top 0.406: 48.26,196.31 Q.3
  Top 0.61: v55.24,193.04 49.53,193.04 48.26,194.31 48.26,196.31
  Bottom 0.61: SV13.4 55.47,202.97 56.52,201.93 56.52,194.31 v55.24,193.04
QRETURN
  Top 0.61: C7.- 3.17,39.37 2.54,38.73 2.54,27.94 3.17,27.3 4.17,27.3 SV7.4
QSEND  (via drill 0.7)
  Top 0.61: v5.08,171.45 40.64,171.45 v45.72,176.53
  Bottom 0.61: SV8.4 4.47,170.84 v5.08,171.45 | v45.72,176.53 45.72,196.35 Q.2

### Text on the board
tPlace: MIN | VOCT | BP | AIN | AIN2 | LP
bPlace: -12